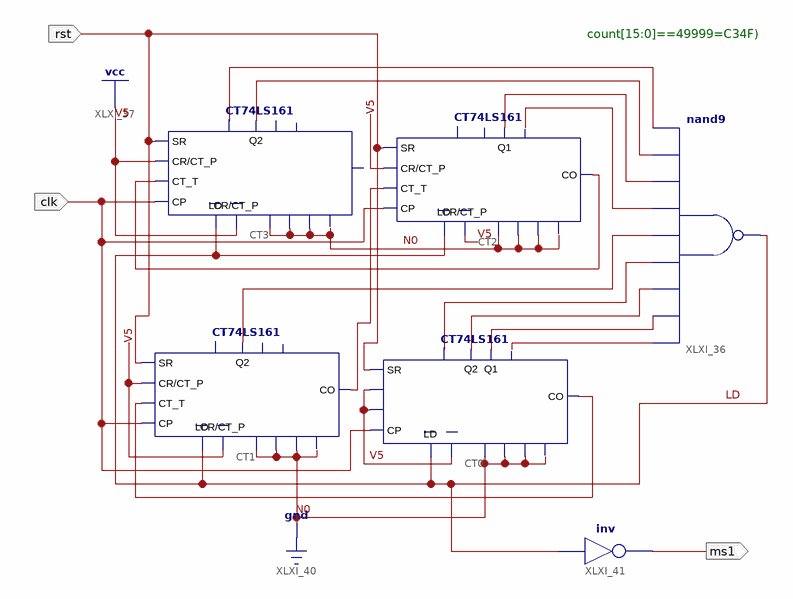
[diagram p0: schematic sheet 1]
// Xilinx ISE schematic ms1.sch (kintex7) as structural Verilog: 6 symbols, 3 ports
module ms1 (
  input  clk,
  input  rst,
  output ms1
);

  wire LD, XLXN_47, XLXN_48, XLXN_49, XLXN_50, XLXN_51, XLXN_52, XLXN_53, XLXN_54, XLXN_55, XLXN_58, XLXN_61,
       XLXN_62;

  CT74LS161 CT3 (
    .D0(1'b0), .D1(1'b0), .D2(1'b0), .D3(1'b0), .CP(clk), .LD(LD), .CR(1'b1), .CT_P(1'b1), .CT_T(XLXN_62),
    .SR(rst), .Q2(XLXN_48), .Q3(XLXN_47));  // open: Q0, Q1, CO
  CT74LS161 CT2 (
    .D0(1'b0), .D1(1'b0), .D2(1'b0), .D3(1'b0), .CP(clk), .LD(LD), .CR(1'b1), .CT_P(1'b1), .CT_T(XLXN_58),
    .SR(rst), .Q0(XLXN_50), .Q1(XLXN_49), .CO(XLXN_62));  // open: Q2, Q3
  CT74LS161 CT1 (
    .D0(1'b0), .D1(1'b0), .D2(1'b0), .D3(1'b0), .CP(clk), .LD(LD), .CR(1'b1), .CT_P(1'b1), .CT_T(XLXN_61),
    .SR(rst), .Q2(XLXN_51), .CO(XLXN_58));  // open: Q0, Q1, Q3
  CT74LS161 CT0 (
    .D0(1'b0), .D1(1'b0), .D2(1'b0), .D3(1'b0), .CP(clk), .LD(LD), .CR(1'b1), .CT_P(1'b1), .CT_T(1'b1),
    .SR(rst), .Q0(XLXN_55), .Q1(XLXN_54), .Q2(XLXN_53), .Q3(XLXN_52), .CO(XLXN_61));
  nand XLXI_36 (LD, XLXN_55, XLXN_54, XLXN_53, XLXN_52, XLXN_51, XLXN_50, XLXN_49, XLXN_48, XLXN_47);
  not XLXI_41 (ms1, LD);

  // Notes on the sheet:
  //   count[15:0]==49999=C34F)
endmodule
